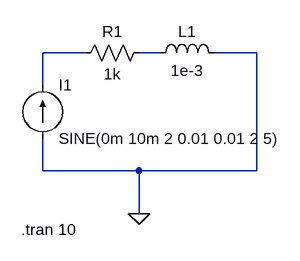
[diagram p0: schematic lead_lag.asc]
lead_lag.asc, the LTspice schematic file:
Version 4.1
SHEET 1 880 680
WIRE 48 128 -16 128
WIRE 160 128 128 128
WIRE 304 128 240 128
WIRE -16 176 -16 128
WIRE -16 304 -16 256
WIRE 128 304 -16 304
WIRE 304 304 304 128
WIRE 304 304 128 304
WIRE 128 368 128 304
FLAG 128 368 0
SYMBOL res 32 144 R270
WINDOW 0 32 56 VTop 2
WINDOW 3 0 56 VBottom 2
SYMATTR InstName R1
SYMATTR Value 1k
SYMBOL ind 144 144 R270
WINDOW 0 32 56 VTop 2
WINDOW 3 5 56 VBottom 2
SYMATTR InstName L1
SYMATTR Value 1e-3
SYMBOL current -16 256 M180
WINDOW 0 24 80 Left 2
WINDOW 3 24 0 Left 2
WINDOW 123 0 0 Left 0
WINDOW 39 0 0 Left 0
SYMATTR InstName I1
SYMATTR Value SINE(0m 10m 2 0.01 0.01 2 5)
TEXT -48 392 Left 2 !.tran 10

The netlist it stands for:
* lead_lag.asc
R1 N001 N002 1k
L1 N002 0 1e-3
I1 0 N001 SINE(0m 10m 2 0.01 0.01 2 5)
.tran 10
.backanno
.end